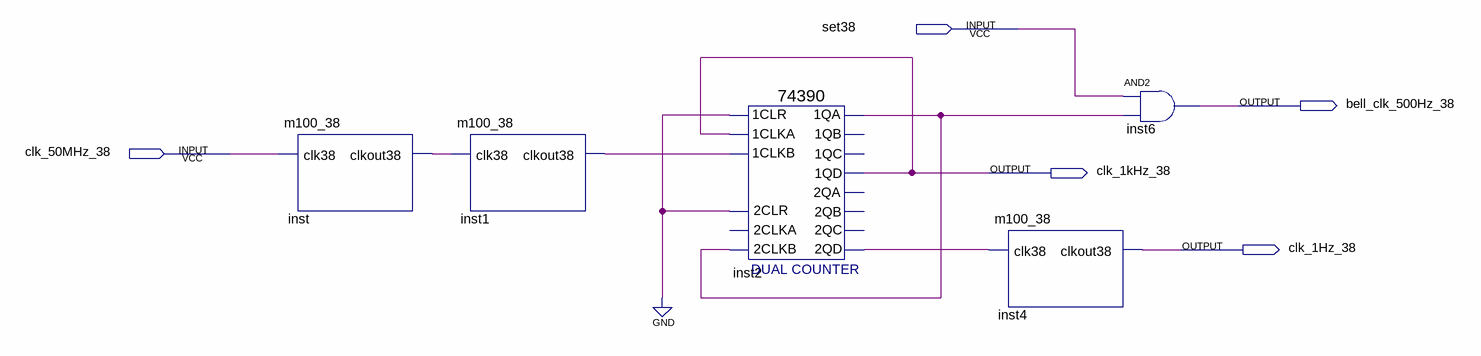
[diagram p0: schematic sheet]
// Quartus schematic fre_div38.bdf as structural Verilog: 5 symbols, 5 pins
module fre_div38 (
  input  set38,
  input  clk_50MHz_38,
  output bell_clk_500Hz_38,
  output clk_1kHz_38,
  output clk_1Hz_38
);

  wire inst1_clkout38, inst2_1qa, inst2_2qd, inst_clkout38;

  m100_38 inst (.clk38(clk_50MHz_38), .clkout38(inst_clkout38));
  m100_38 inst1 (.clk38(inst_clkout38), .clkout38(inst1_clkout38));
  \74390  inst2 (
    .\2CLR (1'b0), .\2CLKB (inst2_1qa), .\1CLR (1'b0), .\1CLKA (clk_1kHz_38), .\1CLKB (inst1_clkout38),
    .\1QA (inst2_1qa), .\1QD (clk_1kHz_38), .\2QD (inst2_2qd));  // open: 2CLKA, 1QB, 1QC, 2QA, 2QB, 2QC
  m100_38 inst4 (.clk38(inst2_2qd), .clkout38(clk_1Hz_38));
  and inst6 (bell_clk_500Hz_38, set38, inst2_1qa);
endmodule
